# EAGLE design power_board (EAGLE 6.5.0)
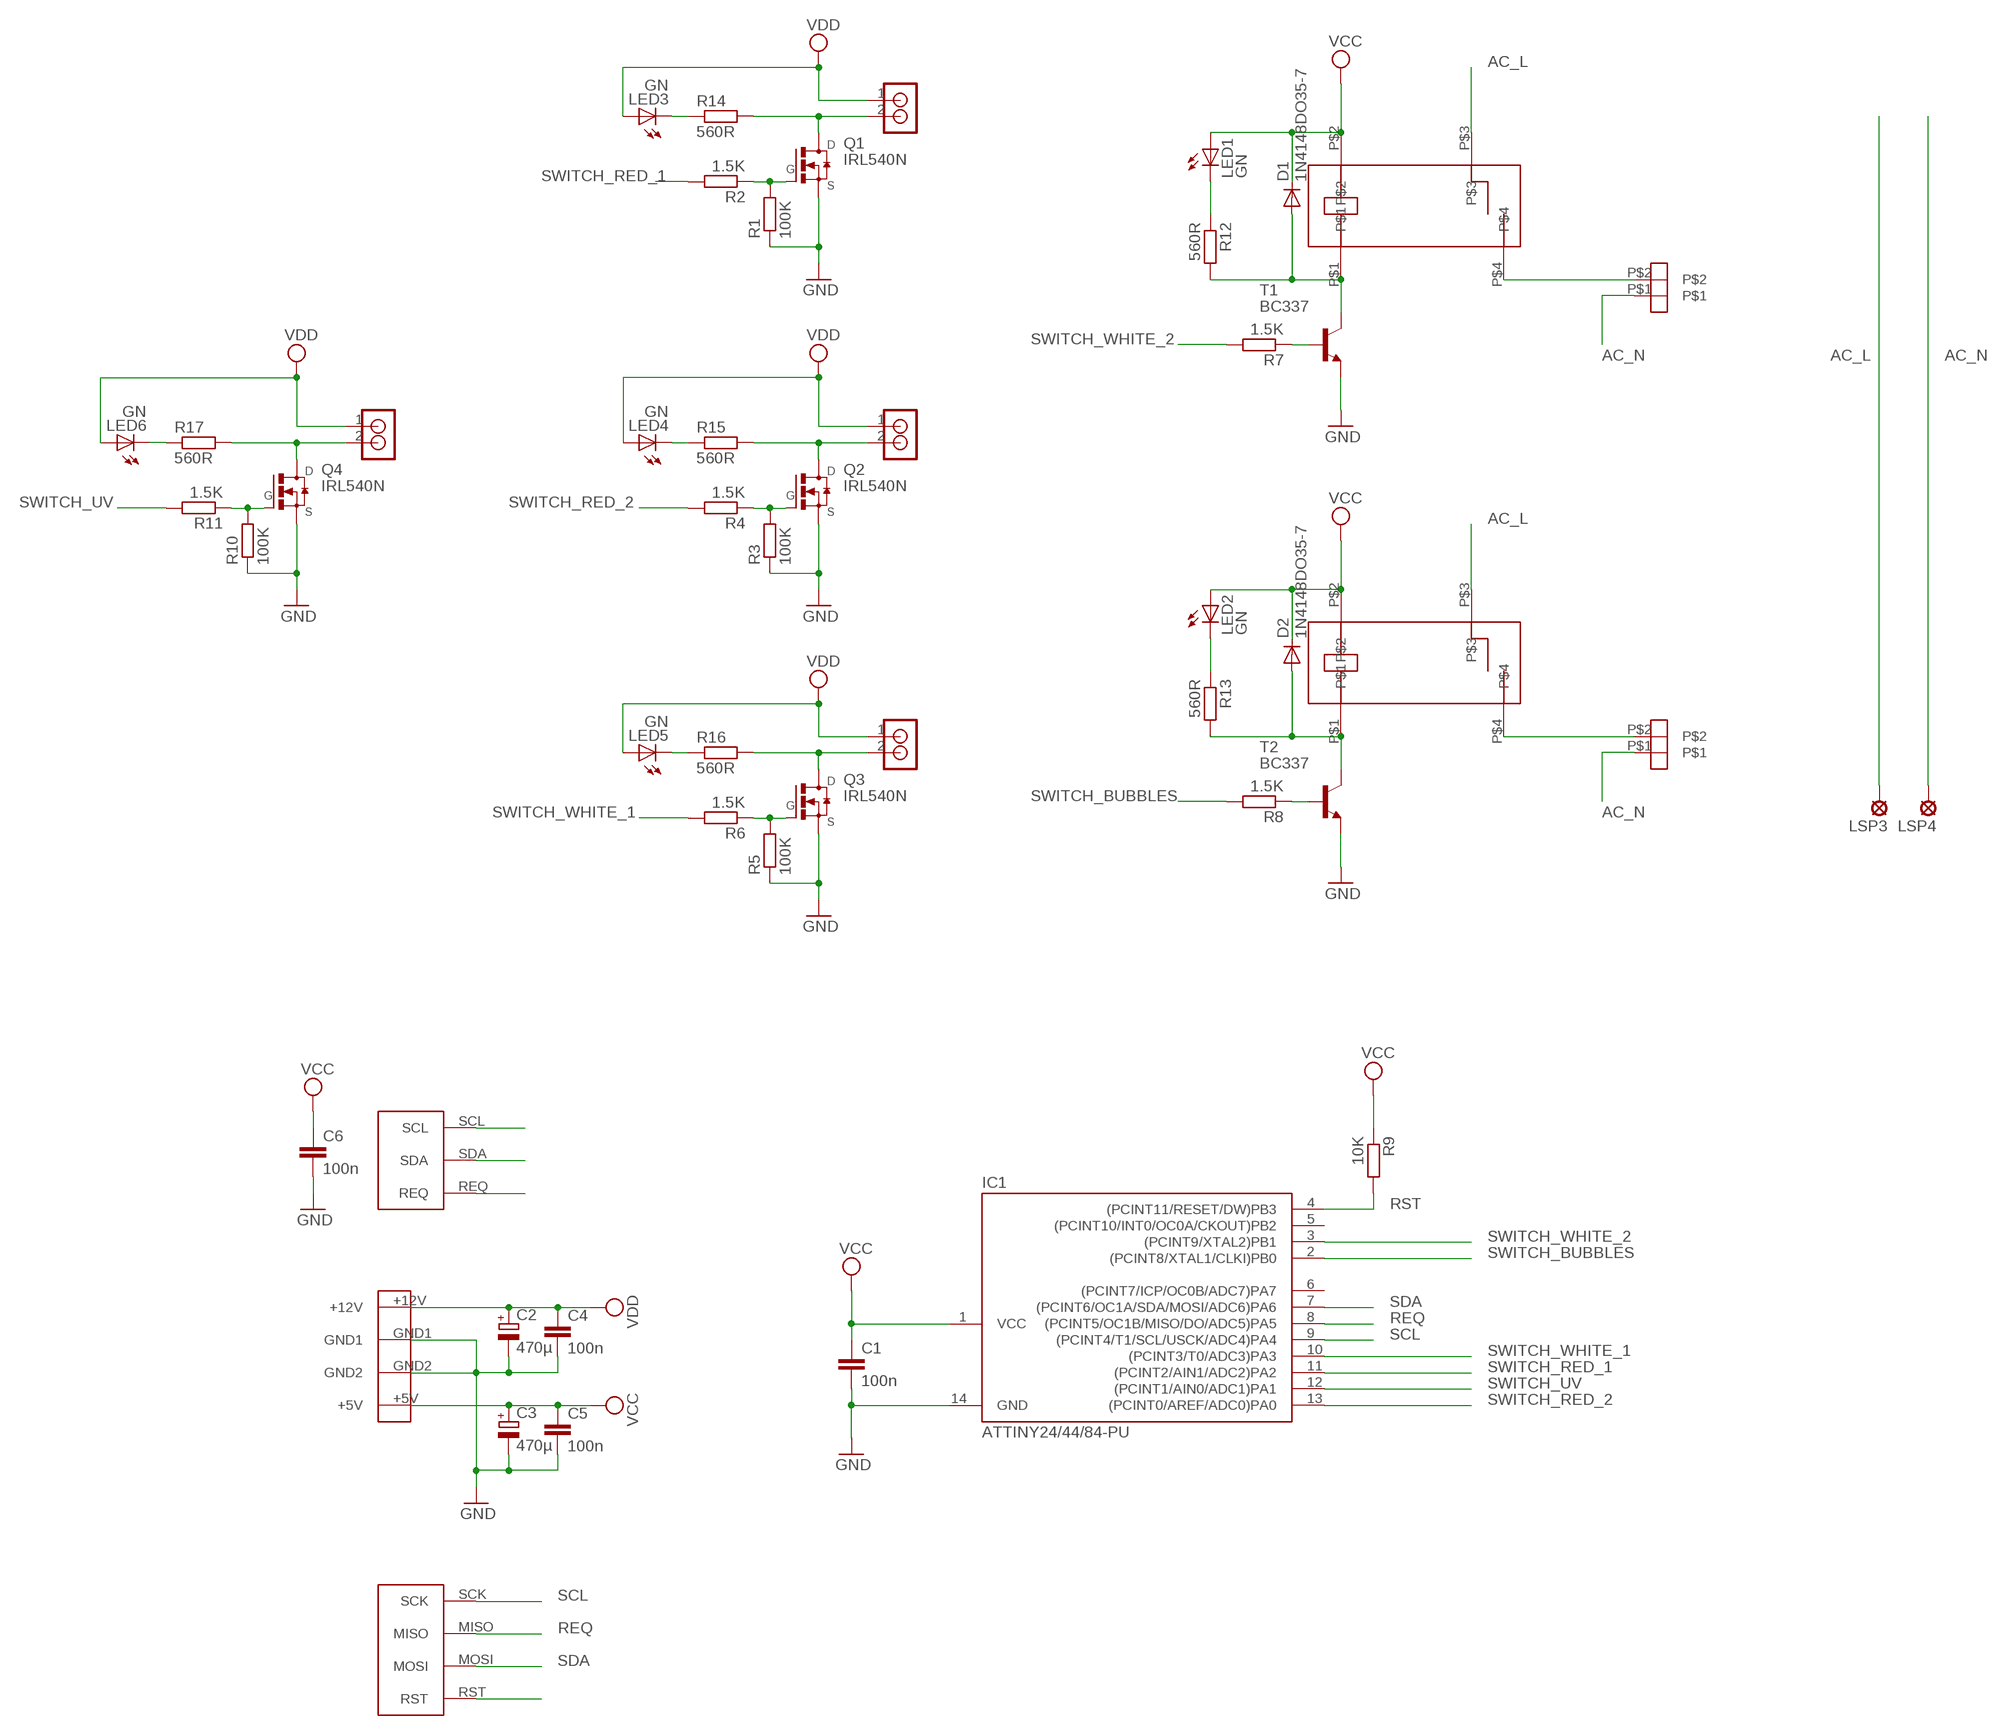
[diagram p0: schematic, sheet 1]

## Parts
BUBBLES_RELAIS  WAGO_734_262  [WAGO_734_262]
C1  100n  C-EU025-024X044  [C025-024X044]
C2  470µ  CPOL-EUE3.5-10  [E3,5-10]
C3  470µ  CPOL-EUE3.5-10  [E3,5-10]
C4  100n  C-EU025-024X044  [C025-024X044]
C5  100n  C-EU025-024X044  [C025-024X044]
C6  100n  C-EU025-024X044  [C025-024X044]
D1  1N4148DO35-7  [DO35-7]
D2  1N4148DO35-7  [DO35-7]
IC1  ATTINY24/44/84-PU  [DIL14]
LED1  GN  LED3MM  [LED3MM]
LED2  GN  LED3MM  [LED3MM]
LED3  GN  LED3MM  [LED3MM]
LED4  GN  LED3MM  [LED3MM]
LED5  GN  LED3MM  [LED3MM]
LED6  GN  LED3MM  [LED3MM]
LSP3  SE14  [SE14]
LSP4  SE14  [SE14]
Q1  IRL540N  [TO220V]
Q2  IRL540N  [TO220V]
Q3  IRL540N  [TO220V]
Q4  IRL540N  [TO220V]
R1  100K  R-EU_0204/5  [0204/5]
R2  1.5K  R-EU_0204/5  [0204/5]
R3  100K  R-EU_0204/5  [0204/5]
R4  1.5K  R-EU_0204/5  [0204/5]
R5  100K  R-EU_0204/5  [0204/5]
R6  1.5K  R-EU_0204/5  [0204/5]
R7  1.5K  R-EU_0204/2V  [0204V]
R8  1.5K  R-EU_0204/2V  [0204V]
R9  10K  R-EU_0207/10  [0207/10]
R10  100K  R-EU_0204/5  [0204/5]
R11  1.5K  R-EU_0204/5  [0204/5]
R12  560R  R-EU_0204/2V  [0204V]
R13  560R  R-EU_0204/2V  [0204V]
R14  560R  R-EU_0207/2V  [0207/2V]
R15  560R  R-EU_0207/2V  [0207/2V]
R16  560R  R-EU_0207/2V  [0207/2V]
R17  560R  R-EU_0207/2V  [0207/2V]
RED_LED_1  RIACON_101_2  [RIACON_101_2]
RED_LED_2  RIACON_101_2  [RIACON_101_2]
T1  BC337  [TO92]
T2  BC337  [TO92]
U$1  I3C_PORT  [I3C_PADS]
U$2  JS_05_MN_KT  [JS_05_MN_KT]
U$3  JS_05_MN_KT  [JS_05_MN_KT]
U$4  PSW_5  [PSW_5]
U$5  AVR_ISP  [AVR_ISP]
UV_LED  RIACON_101_2  [RIACON_101_2]
WHITE_LED  RIACON_101_2  [RIACON_101_2]
WHITE_RELAIS  WAGO_734_262  [WAGO_734_262]

## Nets
AC_L: LSP3.MP U$2.P$3 U$3.P$3
AC_N: BUBBLES_RELAIS.P$1 LSP4.MP WHITE_RELAIS.P$1
GND: C1.2 C2.- C3.- C4.2 C5.2 C6.2 IC1.14(GND) Q1.3(S) Q2.3(S) Q3.3(S) Q4.3(S) R1.1 R3.1 R5.1 R10.1 T1.1(E) T2.1(E) U$4.GND1 U$4.GND2
N$1: Q1.2(D) R14.2 RED_LED_1.2
N$2: Q2.1(G) R3.2 R4.1
N$3: Q1.1(G) R1.2 R2.1
N$4: Q2.2(D) R15.2 RED_LED_2.2
N$5: Q3.1(G) R5.2 R6.1
N$6: Q3.2(D) R16.2 WHITE_LED.2
N$7: R7.1 T1.2(B)
N$8: D1.A R12.2 T1.3(C) U$2.P$1
N$9: R8.1 T2.2(B)
N$10: U$2.P$4 WHITE_RELAIS.P$2
N$11: D2.A R13.2 T2.3(C) U$3.P$1
N$12: BUBBLES_RELAIS.P$2 U$3.P$4
N$13: Q4.1(G) R10.2 R11.1
N$14: Q4.2(D) R17.2 UV_LED.2
N$15: LED1.K(C) R12.1
N$16: LED2.K(C) R13.1
N$17: LED3.K(C) R14.1
N$18: LED5.K(C) R16.1
N$19: LED4.K(C) R15.1
N$21: LED6.K(C) R17.1
REQ: IC1.8((PCINT5/OC1B/MISO/DO/ADC5)PA5) U$1.REQ U$5.MISO
RST: IC1.4((PCINT11/RESET/DW)PB3) R9.2 U$5.RST
SCL: IC1.9((PCINT4/T1/SCL/USCK/ADC4)PA4) U$1.SCL U$5.SCK
SDA: IC1.7((PCINT6/OC1A/SDA/MOSI/ADC6)PA6) U$1.SDA U$5.MOSI
SWITCH_BUBBLES: IC1.2((PCINT8/XTAL1/CLKI)PB0) R8.2
SWITCH_RED_1: IC1.11((PCINT2/AIN1/ADC2)PA2) R2.2
SWITCH_RED_2: IC1.13((PCINT0/AREF/ADC0)PA0) R4.2
SWITCH_UV: IC1.12((PCINT1/AIN0/ADC1)PA1) R11.2
SWITCH_WHITE_1: IC1.10((PCINT3/T0/ADC3)PA3) R6.2
SWITCH_WHITE_2: IC1.3((PCINT9/XTAL2)PB1) R7.2
VCC: C1.1 C3.+ C5.1 C6.1 D1.C D2.C IC1.1(VCC) LED1.A LED2.A R9.1 U$2.P$2 U$3.P$2 U$4.+5V
VDD: C2.+ C4.1 LED3.A LED4.A LED5.A LED6.A RED_LED_1.1 RED_LED_2.1 U$4.+12V UV_LED.1 WHITE_LED.1
Unconnected: IC1.5((PCINT10/INT0/OC0A/CKOUT)PB2) IC1.6((PCINT7/ICP/OC0B/ADC7)PA7)

## Power pins joined to a net without a drawn wire
GND: U$1.GND U$5.GND
VCC: U$1.VCC U$5.VCC

## Library data of the parts
BUBBLES_RELAIS WHITE_RELAIS = n39:WAGO_734_262: WAGO 743-262 Print-Stiftleiste, Mini, RM 3,81, gewinkelt, 2-polig http://www.reichelt.de/?ARTICLE=45978
C1 C4-C6 = resistor:C-EU: CAPACITOR, European symbol
C2 C3 = resistor:CPOL-EU: POLARIZED CAPACITOR, European symbol
D1 D2 = diode:1N4148: DIODE high speed (Philips)
IC1 = attiny24_44_84:ATTINY24/44/84
LED1-LED6 = led:LED: LED OSRAM: - CHIPLED LG R971, LG N971, LY N971, LG Q971, LY Q971, LO R971, LY R971 LH N974, LH R974 LS Q976, LO Q976, LY Q976 LO Q996 - Hyper CHIPLED LW Q18S LB Q993, LB Q99A, LB R99A - SideLED LS A670, LO A670, LY A670, LG A670, LP A670 LB A673, LV A673, LT A673, LW A673 LH A674 LY A675 LS A676, LA A676, LO A676, LY A676, LW A676 LS A679, LY A679, LG A679 - Hyper Micro SIDELED® LS Y876, LA Y876, LO Y876, LY Y876 LT Y87S - SmartLED LW L88C, LW L88S LB L89C, LB L89S, LG L890 LS L89K, LO L89K, LY L89K LS L896, LA L896, LO L896, LY L896 - TOPLED LS T670, LO T670, LY T670, LG T670, LP T670 LSG T670, LSP T670, LSY T670, LOP T670, LYG T670 LG T671, LOG T671, LSG T671 LB T673, LV T673, LT T673, LW T673 LH T674 LS T676, LA T676, LO T676, LY T676, LB T676, LH T676, LSB T676, LW T676 LB T67C, LV T67C, LT T67C, LS T67K, LO T67K, LY T67K, LW E67C LS E67B, LA E67B, LO E67B, LY E67B, LB E67C, LV E67C, LT E67C LW T67C LS T679, LY T679, LG T679 LS T770, LO T770, LY T770, LG T770, LP T770 LB T773, LV T773, LT T773, LW T773 LH T774 LS E675, LA E675, LY E675, LS T675 LS T776, LA T776, LO T776, LY T776, LB T776 LHGB T686 LT T68C, LB T68C - Hyper Mini TOPLED® LB M676 - Mini TOPLED Santana® LG M470 LS M47K, LO M47K, LY M47K Source: http://www.osram.convergy.de LUXEON: - LUMILED® LXK2-PW12-R00, LXK2-PW12-S00, LXK2-PW14-U00, LXK2-PW14-V00 LXK2-PM12-R00, LXK2-PM12-S00, LXK2-PM14-U00 LXK2-PE12-Q00, LXK2-PE12-R00, LXK2-PE12-S00, LXK2-PE14-T00, LXK2-PE14-U00 LXK2-PB12-K00, LXK2-PB12-L00, LXK2-PB12-M00, LXK2-PB14-N00, LXK2-PB14-P00, LXK2-PB14-Q00 LXK2-PR12-L00, LXK2-PR12-M00, LXK2-PR14-Q00, LXK2-PR14-R00 LXK2-PD12-Q00, LXK2-PD12-R00, LXK2-PD12-S00 LXK2-PH12-R00, LXK2-PH12-S00 LXK2-PL12-P00, LXK2-PL12-Q00, LXK2-PL12-R00 Source: www.luxeon.com KINGBRIGHT: KA-3528ASYC Source: www.kingbright.com
LSP3 LSP4 = solpad:SE14: SOLDER PAD E1553, drill 1,4mm, distributor Buerklin, 07F820
Q1-Q4 = n39:IRL540N: IRL540NPbF HEXFET ® Power MOSFET; AUTOR: Tux; REICHELT: IRL 540N
R1-R17 = resistor:R-EU_: RESISTOR, European symbol
RED_LED_1 RED_LED_2 UV_LED WHITE_LED = n39:RIACON_101_2: RIACON Anschlussklemme (AKL) Typ 101 Rastermaß 5,08 mm; REICHELT: AKL 101-02
T1 T2 = transistor:BC337: NPN TRANSISTOR
U$1 = n39:I3C_PORT: I³C Port I³C is I²C with an additional request line, which a client can pull down to signal relevant state changes and trigger the master to poll data, and GND+VCC lines. Author: Tux
U$2 U$3 = n39:JS_05_MN_KT
U$4 = n39:PSW_5: PSW 5 Stromversorgungsstecker f. 5 1/4 Zoll, Print, gew. http://www.reichelt.de/?ARTICLE=14915
U$5 = n39:AVR_ISP: AVR ISP Pinheader Belegung: 1: MISO 2: VCC 3: SCK 4: MOSI 5: Reset 6: GND

## Board
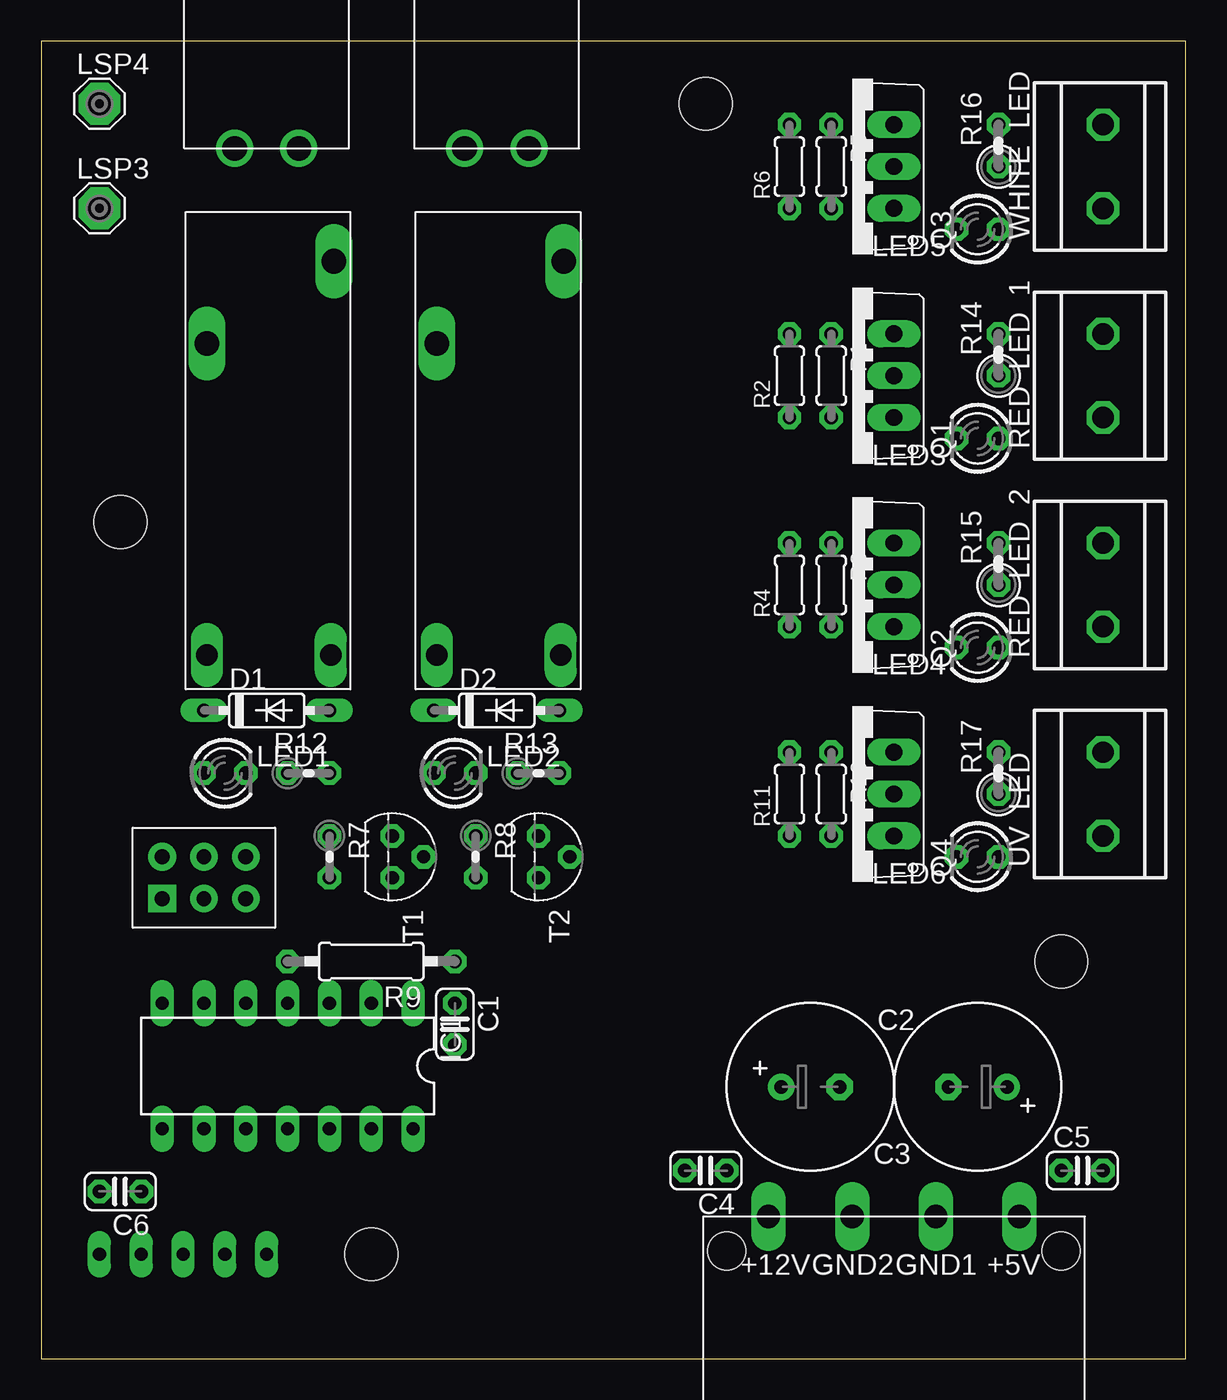
[diagram p1: board, top side]
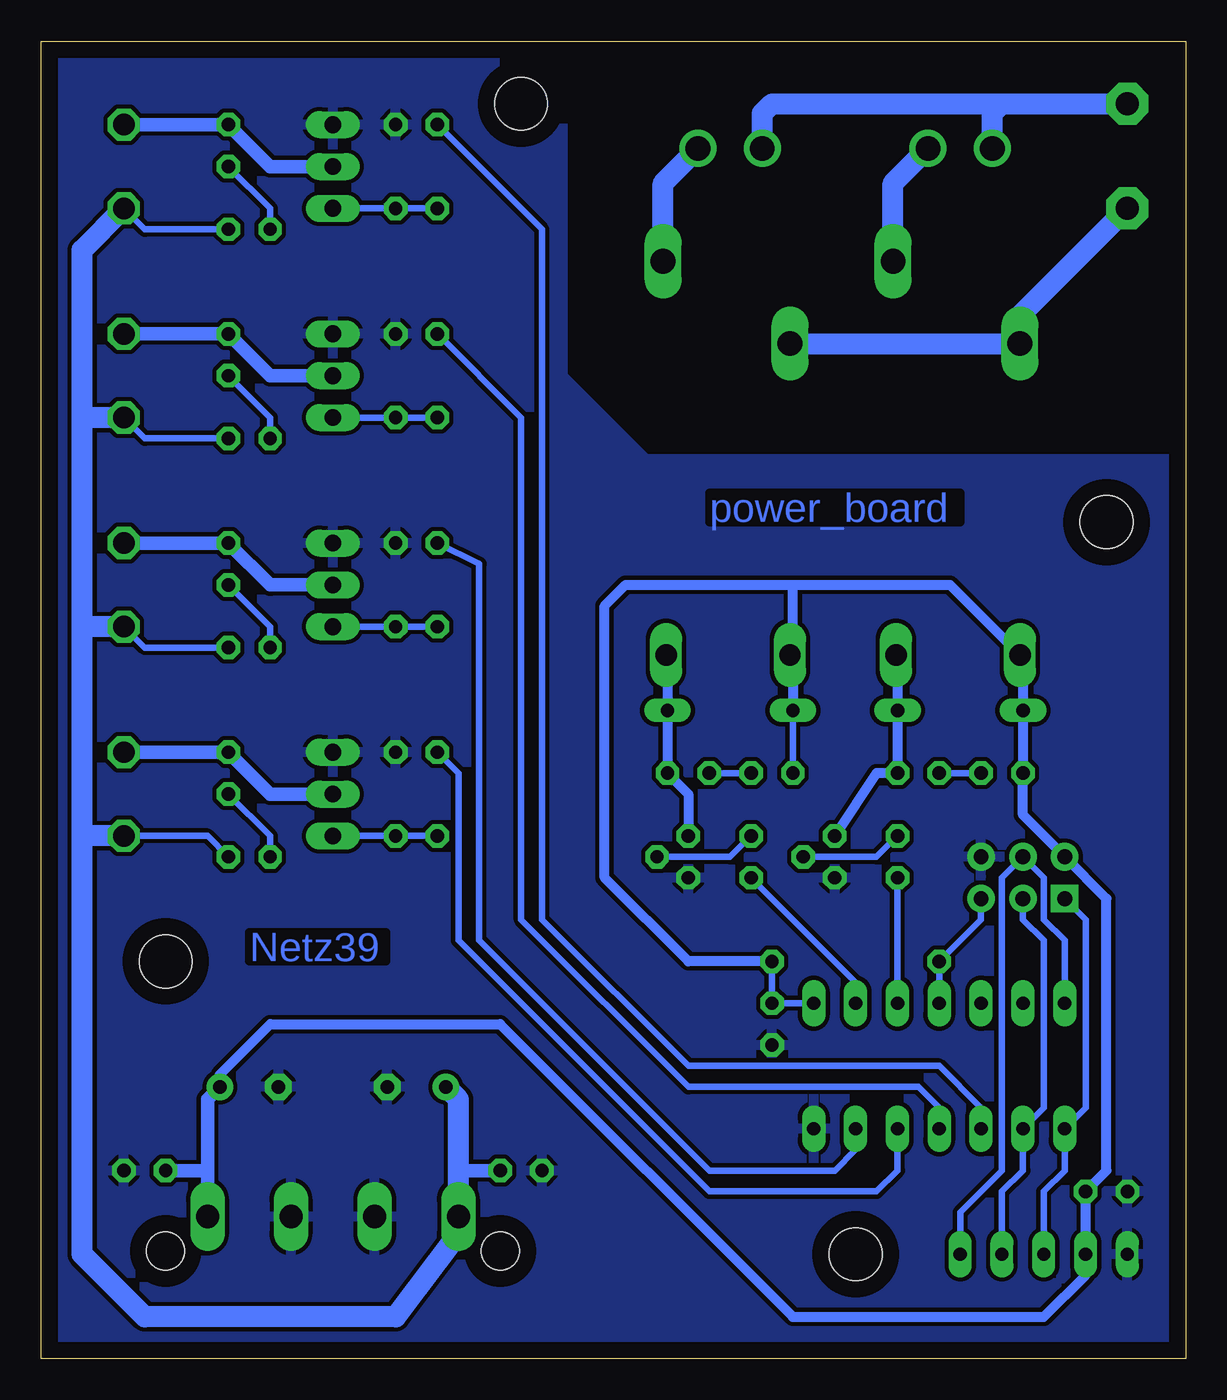
[diagram p2: board, bottom side, seen from below]

Size 69.52 x 80 mm. Coordinates in mm from the lower left corner, seen from the top.
Outline: 0,0 69.52,0 69.52,80 0,80 0,0
Copper layers (1*16): Top 0.035mm / dielectric 1.5mm / Bottom 0.035mm
Design rules "default *": minimum track width 12mil, minimum drill 24mil, track to track 8mil, track to pad 8mil, pad to pad 8mil, via to via 8mil, smd to smd 8mil, copper to edge 40mil, drill to drill 8mil, minimum pad ring 12mil, minimum via ring 10mil, stop-mask expansion 4mil, vias tented up to drill 0mil, thermal gap 10mil
Holes 3.2 mm at 61.96,24.13 40.37,76.2 4.81,50.8 20.05,6.35

### Footprints (pad centres in the part's own frame; a part is rotated, then mirrored left to right if it is on the bottom)
WAGO_734_262 = drill 1.5: P$1 -1.95,-5.25; P$2 1.95,-5.25
C025-024X044 = drill 0.813 octagon: 1 -1.27,0; 2 1.27,0
E3,5-10 = drill 0.813 pad 1.6: + -1.778,0 | drill 0.813 pad 1.6 octagon: - 1.778,0
DO35-7 = drill 0.813 long: A 3.81,0; C -3.81,0
DIL14 = drill 0.813 long: 1 -7.62,-3.81; 2 -5.08,-3.81; 3 -2.54,-3.81; 4 0,-3.81; 5 2.54,-3.81; 6 5.08,-3.81; 7 7.62,-3.81; 8 7.62,3.81; 9 5.08,3.81; 10 2.54,3.81; 11 0,3.81; 12 -2.54,3.81; 13 -5.08,3.81; 14 -7.62,3.81
LED3MM = drill 0.813 octagon: A -1.27,0; K 1.27,0
SE14 = drill 1.397 pad 2.54 octagon: MP 0,0
TO220V = drill 1.016 long: 1 -2.54,-2.54; 2 0,-2.54; 3 2.54,-2.54
0204/5 = drill 0.813 octagon: 1 -2.54,0; 2 2.54,0
0204V = drill 0.813 octagon: 1 -1.27,0; 2 1.27,0
0207/10 = drill 0.813 octagon: 1 -5.08,0; 2 5.08,0
0207/2V = drill 0.813 octagon: 1 -1.27,0; 2 1.27,0
RIACON_101_2 = drill 1.3 octagon: 1 -2.54,0; 2 2.54,0
TO92 = drill 0.813 octagon: 1 1.27,0; 2 0,1.905; 3 -1.27,0
I3C_PADS = drill 0.8 long: GND 0,5.08; REQ 0,0; SCL 0,-2.54; SDA 0,-5.08; VCC 0,2.54
JS_05_MN_KT = drill 1.3 long: P$1 2.1,1.19; P$2 2.1,8.71 | drill 1.5 long: P$3 21,8.71; P$4 26,1
PSW_5 = drill 1.4 long: +5V -7.62,-6.1; +12V 7.62,-6.1; GND1 -2.54,-6.1; GND2 2.54,-6.1 | hole 2.3: -10.16,-4; 10.16,-4
AVR_ISP = drill 0.9 pad 1.676: GND 1.27,-2.54; MOSI 1.27,0; RST -1.27,-2.54; SCK -1.27,0; VCC 1.27,2.54 | drill 0.9 pad 1.676 square: MISO -1.27,2.54

### Placement (x,y rotation side)
BUBBLES_RELAIS  27.67,78.74 0 top
C1  25.13,20.32 270 top
C2  46.72,16.51 0 top
C3  56.88,16.51 180 top
C4  40.37,11.43 180 top
C5  63.23,11.43 0 top
C6  4.81,10.16 180 top
D1  13.7,39.37 0 top
D2  27.67,39.37 0 top
IC1  14.97,17.78 180 top
LED1  11.16,35.56 0 top
LED2  25.13,35.56 0 top
LED3  56.88,55.88 180 top
LED4  56.88,43.18 180 top
LED5  56.88,68.58 180 top
LED6  56.88,30.48 180 top
LSP3  3.54,69.85 0 top
LSP4  3.54,76.2 0 top
Q1  49.26,59.69 90 top
Q2  49.26,46.99 90 top
Q3  49.26,72.39 90 top
Q4  49.26,34.29 90 top
R1  47.99,59.69 270 top
R2  45.45,59.69 90 top
R3  47.99,46.99 270 top
R4  45.45,46.99 90 top
R5  47.99,72.39 270 top
R6  45.45,72.39 90 top
R7  17.51,30.48 270 top
R8  26.4,30.48 270 top
R9  20.05,24.13 180 top
R10  47.99,34.29 270 top
R11  45.45,34.29 90 top
R12  16.24,35.56 0 top
R13  30.21,35.56 0 top
R14  58.15,60.96 90 top
R15  58.15,48.26 90 top
R16  58.15,73.66 90 top
R17  58.15,35.56 90 top
RED_LED_1  64.5,59.69 90 top
RED_LED_2  64.5,46.99 90 top
T1  21.32,30.48 270 top
T2  30.21,30.48 270 top
U$1  8.62,6.35 90 top
U$2  18.78,40.64 90 top
U$3  32.75,40.64 90 top
U$4  51.8,2.54 180 top
U$5  9.89,29.21 90 top
UV_LED  64.5,34.29 90 top
WHITE_LED  64.5,72.39 90 top
WHITE_RELAIS  13.7,78.74 0 top

### Tracks (layer width: path | path; a pad name or v marks a point on that pad's centre or on a via)
AC_L
  Bottom 1.27: U$3.P$3 U$2.P$3 10.07,63.32 LSP3.MP
AC_N
  Bottom 1.27: 11.16,76.2 25.13,76.2 25.72,75.61 BUBBLES_RELAIS.P$1 | 11.16,76.2 LSP4.MP | WHITE_RELAIS.P$1 11.75,75.61 11.16,76.2
GND
  pour Bottom (isolate 0.254): 69.58,80.01 69.58,0 1,0 1,54.61 32.75,54.61 37.83,59.69 37.83,80.01
N$1
  Bottom 0.813: Q1.2 55.61,59.69 R14.2 RED_LED_1.2
N$2
  Bottom 0.406: R4.1 R3.2 Q2.1
N$3
  Bottom 0.406: R2.1 R1.2 Q1.1
N$4
  Bottom 0.813: Q2.2 55.61,46.99 R15.2 RED_LED_2.2
N$5
  Bottom 0.406: R6.1 R5.2 Q3.1
N$6
  Bottom 0.813: Q3.2 55.61,72.39 R16.2 WHITE_LED.2
N$7
  Bottom 0.406: R7.1 18.78,30.48 T1.2
N$8
  Bottom 0.61: U$2.P$1 17.51,42.66 D1.A R12.2 18.78,35.56 T1.3
N$9
  Bottom 0.406: R8.1 27.67,30.48 T2.2
N$10
  Bottom 1.27: U$2.P$4 17.78,71.36 WHITE_RELAIS.P$2
N$11
  Bottom 0.61: U$3.P$1 31.48,42.66 D2.A R13.2 30.21,34.29 T2.3
N$12
  Bottom 1.27: U$3.P$4 31.75,71.36 BUBBLES_RELAIS.P$2
N$13
  Bottom 0.406: Q4.1 R10.2 R11.1
N$14
  Bottom 0.813: Q4.2 55.61,34.29 R17.2 UV_LED.2
N$15
  Bottom 0.406: LED1.K R12.1
N$16
  Bottom 0.406: LED2.K R13.1
N$17
  Bottom 0.406: LED3.K 55.61,57.15 R14.1
N$18
  Bottom 0.406: LED5.K 55.61,69.85 R16.1
N$19
  Bottom 0.406: LED4.K 55.61,44.45 R15.1
N$21
  Bottom 0.406: LED6.K 55.61,31.75 R17.1
REQ
  Bottom 0.406: U$1.REQ 8.62,10.16 7.35,11.43 IC1.8 6.08,15.24 6.08,26.67 U$5.MISO
RST
  Bottom 0.406: U$5.RST 12.43,26.67 R9.2 IC1.4
SCL
  Bottom 0.406: U$1.SCL 11.16,10.16 9.89,11.43 IC1.9 8.62,15.24 8.62,25.4 9.89,26.67 U$5.SCK
SDA
  Bottom 0.406: U$1.SDA 13.7,8.89 11.16,11.43 11.16,29.21 U$5.MOSI 8.62,29.21 8.62,26.67 7.35,25.4 IC1.7
SWITCH_BUBBLES
  Bottom 0.406: IC1.2 20.05,22.86 R8.2
SWITCH_RED_1
  Bottom 0.406: IC1.11 14.97,15.24 16.24,16.51 30.21,16.51 40.37,26.67 40.37,57.15 R2.2
SWITCH_RED_2
  Bottom 0.406: IC1.13 20.05,12.7 21.32,11.43 28.94,11.43 42.91,25.4 42.91,48.26 R4.2
SWITCH_UV
  Bottom 0.406: R11.2 44.18,35.56 44.18,25.4 28.94,10.16 18.78,10.16 17.51,11.43 IC1.12
SWITCH_WHITE_1
  Bottom 0.406: IC1.10 12.43,15.24 14.97,17.78 30.21,17.78 39.1,26.67 39.1,68.58 R6.2
SWITCH_WHITE_2
  Bottom 0.406: IC1.3 R7.2
VCC
  Bottom 0.406: LED2.A D2.C | R9.1 C1.1 IC1.1 | U$3.P$2 23.86,42.56
  Bottom 0.61: 23.86,42.56 D2.C | R9.1 30.21,24.13 35.29,29.21 35.29,45.72 34.02,46.99 23.86,46.99 | 23.86,46.99 14.32,46.99 U$2.P$2 9.89,42.56 D1.C LED1.A 9.89,33.02 U$5.VCC 4.81,27.94 4.81,11.43 C6.1 U$1.VCC 6.08,5.08 8.62,2.54 23.86,2.54 41.64,20.32 55.61,20.32 58.66,17.27 C3.+ | U$3.P$2 23.86,42.92 23.86,46.99
  Bottom 0.813: U$4.+5V 59.42,11.43 | 59.42,11.43 59.42,15.75 C3.+ | C5.1 59.42,11.43
VDD
  Bottom 0.406: LED3.A 63.23,55.88 RED_LED_1.1 | LED4.A 63.23,43.18 RED_LED_2.1 | LED5.A 63.23,68.58 WHITE_LED.1 | LED6.A 59.42,31.75 UV_LED.1
  Bottom 0.813: C4.1 44.18,11.43
  Bottom 1.27: RED_LED_1.1 67.04,57.15 | 67.04,57.15 67.04,67.31 WHITE_LED.1 | RED_LED_2.1 67.04,44.45 | 67.04,44.45 67.04,57.15 | UV_LED.1 67.04,31.75 | 67.04,31.75 67.04,44.45 | 67.04,31.75 67.04,6.35 63.23,2.54 47.99,2.54 44.18,7.62 U$4.+12V 44.18,11.43 44.18,15.75 C2.+

### Text on the board
Bottom: power_board | Netz39